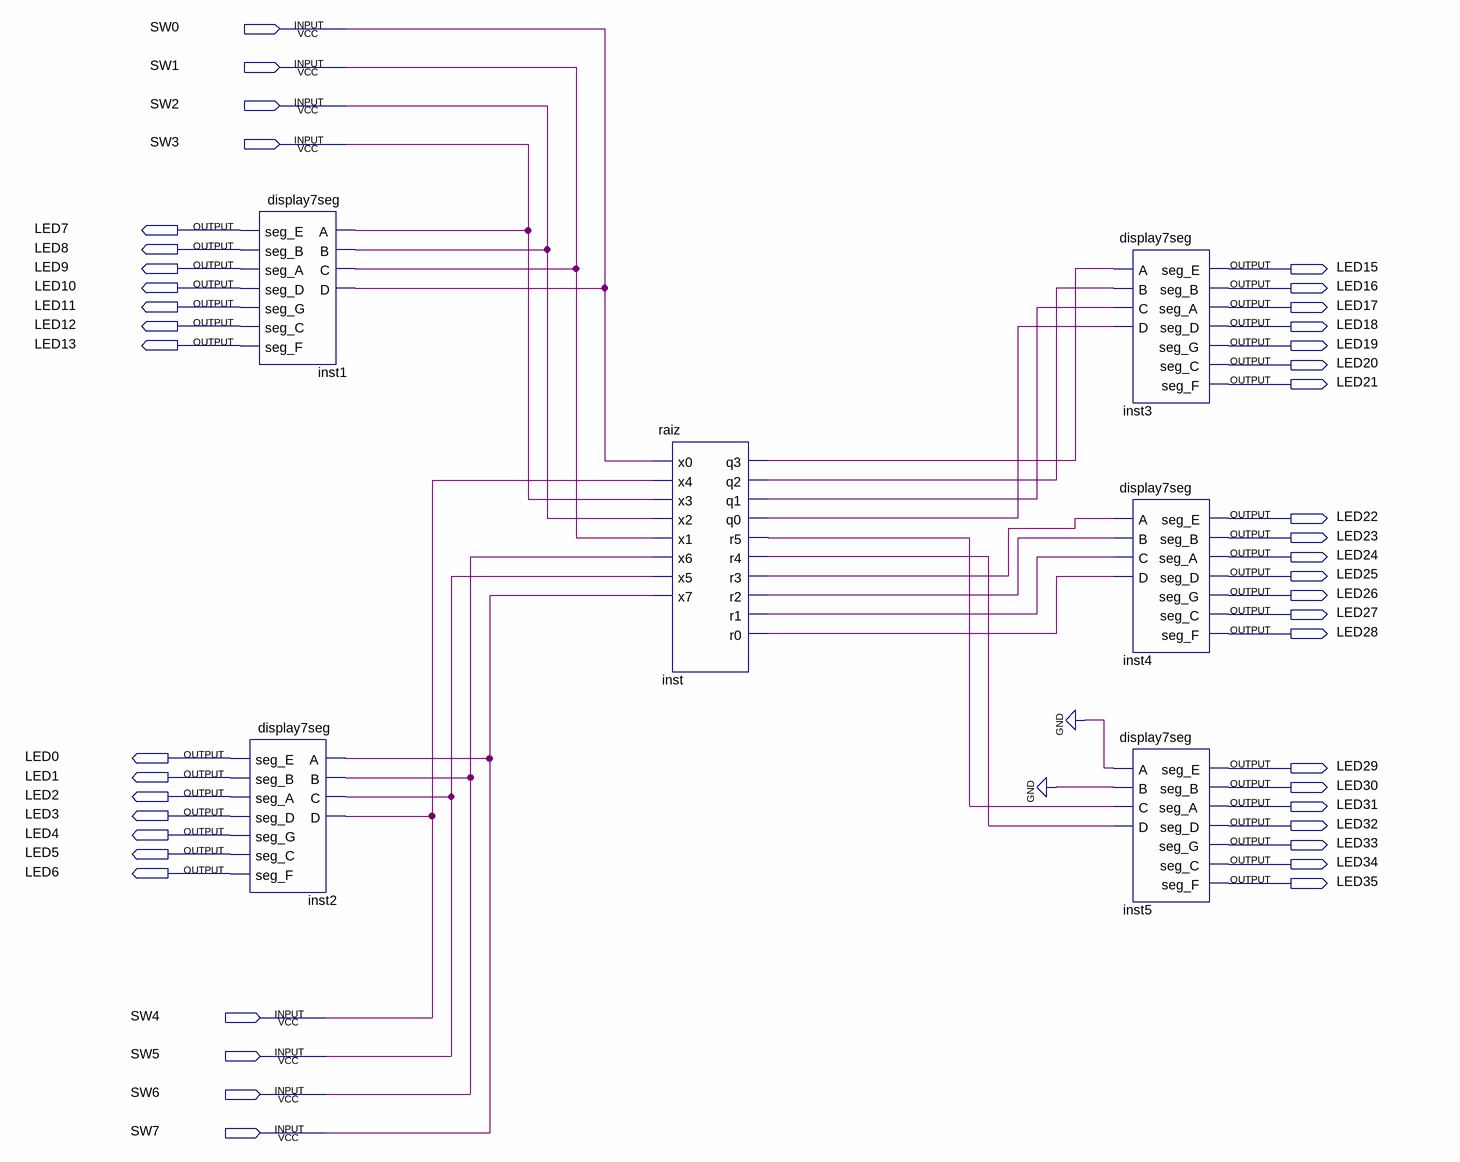
[diagram p0: schematic sheet]
// Quartus schematic raiz_enviar.bdf as structural Verilog: 6 symbols, 43 pins
module raiz_enviar (
  input  SW0,
  input  SW1,
  input  SW2,
  input  SW3,
  input  SW4,
  input  SW5,
  input  SW6,
  input  SW7,
  output LED7,
  output LED8,
  output LED9,
  output LED15,
  output LED10,
  output LED16,
  output LED11,
  output LED17,
  output LED12,
  output LED18,
  output LED13,
  output LED19,
  output LED20,
  output LED21,
  output LED22,
  output LED23,
  output LED24,
  output LED25,
  output LED26,
  output LED27,
  output LED28,
  output LED0,
  output LED29,
  output LED1,
  output LED30,
  output LED2,
  output LED31,
  output LED3,
  output LED32,
  output LED4,
  output LED33,
  output LED5,
  output LED34,
  output LED6,
  output LED35
);

  wire inst_q0, inst_q1, inst_q2, inst_q3, inst_r0, inst_r1, inst_r2, inst_r3, inst_r4, inst_r5;

  display7seg inst1 (
    .A(SW3), .B(SW2), .C(SW1), .D(SW0), .seg_E(LED7), .seg_B(LED8), .seg_A(LED9), .seg_D(LED10),
    .seg_G(LED11), .seg_C(LED12), .seg_F(LED13));
  display7seg inst2 (
    .A(SW7), .B(SW6), .C(SW5), .D(SW4), .seg_E(LED0), .seg_B(LED1), .seg_A(LED2), .seg_D(LED3), .seg_G(LED4),
    .seg_C(LED5), .seg_F(LED6));
  raiz inst (
    .x0(SW0), .x4(SW4), .x3(SW3), .x2(SW2), .x1(SW1), .x6(SW6), .x5(SW5), .x7(SW7), .q3(inst_q3),
    .q2(inst_q2), .q1(inst_q1), .q0(inst_q0), .r5(inst_r5), .r4(inst_r4), .r3(inst_r3), .r2(inst_r2),
    .r1(inst_r1), .r0(inst_r0));
  display7seg inst3 (
    .A(inst_q3), .B(inst_q2), .C(inst_q1), .D(inst_q0), .seg_E(LED15), .seg_B(LED16), .seg_A(LED17),
    .seg_D(LED18), .seg_G(LED19), .seg_C(LED20), .seg_F(LED21));
  display7seg inst4 (
    .A(inst_r3), .B(inst_r2), .C(inst_r1), .D(inst_r0), .seg_E(LED22), .seg_B(LED23), .seg_A(LED24),
    .seg_D(LED25), .seg_G(LED26), .seg_C(LED27), .seg_F(LED28));
  display7seg inst5 (
    .A(1'b0), .B(1'b0), .C(inst_r5), .D(inst_r4), .seg_E(LED29), .seg_B(LED30), .seg_A(LED31), .seg_D(LED32),
    .seg_G(LED33), .seg_C(LED34), .seg_F(LED35));
endmodule
